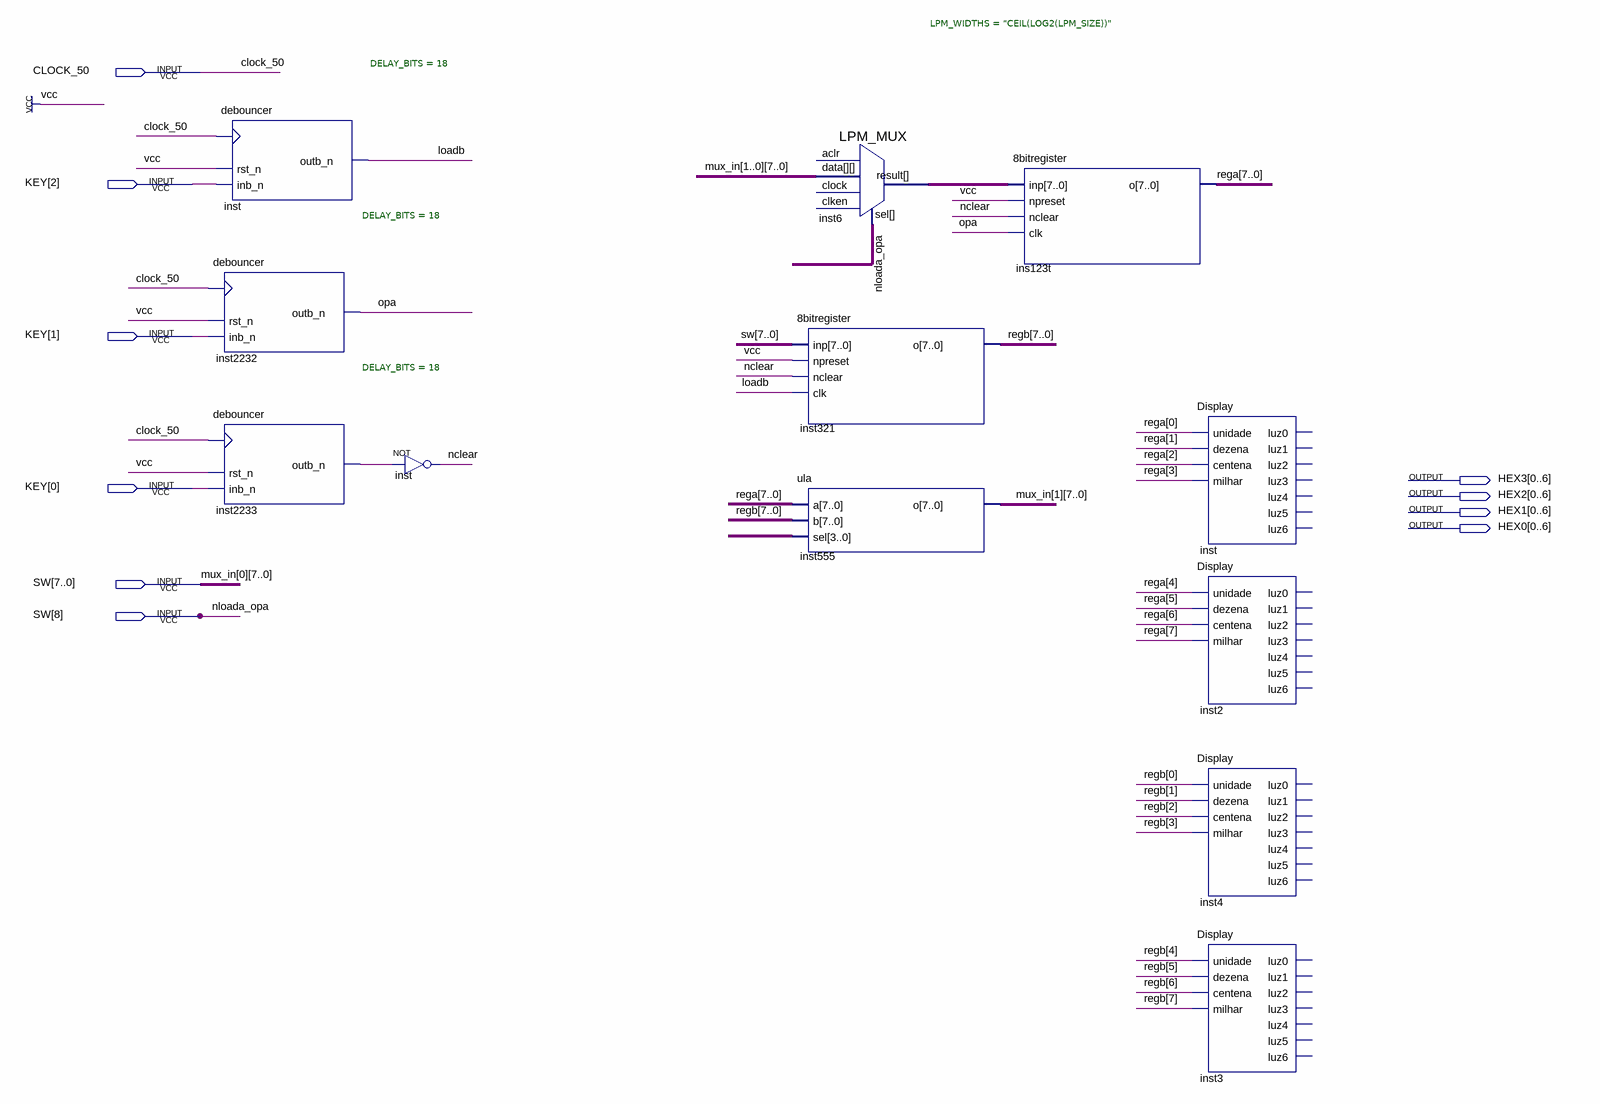
[diagram p0: schematic sheet]
// Quartus schematic ula_com_memoria.bdf as structural Verilog: 12 symbols, 10 pins
module ula_com_memoria (
  input  CLOCK_50,
  input  [2:0] KEY,
  input  [8:0] SW,
  output [0:6] HEX3,
  output [0:6] HEX2,
  output [0:6] HEX1,
  output [0:6] HEX0
);

  wire inst2233_outb_n, loadb, nclear, opa;
  wire [3:0] undriven;
  wire [7:0] inst6_result, mux_in_1, rega, regb;

  debouncer #(.DELAY_BITS(18)) inst (.rst_n(1'b1), .inb_n(KEY[2]), .clk(CLOCK_50), .outb_n(loadb));
  debouncer #(.DELAY_BITS(18)) inst2232 (.rst_n(1'b1), .inb_n(KEY[1]), .clk(CLOCK_50), .outb_n(opa));
  debouncer #(.DELAY_BITS(18)) inst2233 (.rst_n(1'b1), .inb_n(KEY[0]), .clk(CLOCK_50), .outb_n(inst2233_outb_n));
  not inst_dup2 (nclear, inst2233_outb_n);
  LPM_MUX #(.LPM_WIDTHS("CEIL(LOG2(LPM_SIZE))")) inst6 (
    .data({mux_in_1, SW[7:0]}), .sel(SW[8]), .result(inst6_result));  // open: clock, aclr, clken
  \8bitregister  inst321 (.inp(SW[7:0]), .npreset(1'b1), .nclear(nclear), .clk(loadb), .o(regb));
  ula inst555 (.a(rega), .b(regb), .sel(undriven), .o(mux_in_1));
  \8bitregister  ins123t (.inp(inst6_result), .npreset(1'b1), .nclear(nclear), .clk(opa), .o(rega));
  Display inst_dup3 (
    .unidade(rega[0]), .dezena(rega[1]), .centena(rega[2]), .milhar(rega[3]));  // open: luz0, luz1, luz2, luz3, luz4, luz5, luz6
  Display inst2 (
    .unidade(rega[4]), .dezena(rega[5]), .centena(rega[6]), .milhar(rega[7]));  // open: luz0, luz1, luz2, luz3, luz4, luz5, luz6
  Display inst4 (
    .unidade(regb[0]), .dezena(regb[1]), .centena(regb[2]), .milhar(regb[3]));  // open: luz0, luz1, luz2, luz3, luz4, luz5, luz6
  Display inst3 (
    .unidade(regb[4]), .dezena(regb[5]), .centena(regb[6]), .milhar(regb[7]));  // open: luz0, luz1, luz2, luz3, luz4, luz5, luz6

  // Other names for the same wires on the sheet: mux_in_0[7:0] = SW[7:0]; nloada_opa = SW[8]
endmodule
